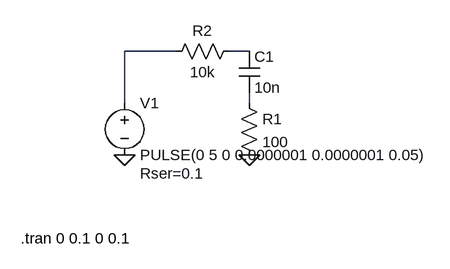
[diagram p0: schematic lowpass-trigger.asc]
lowpass-trigger.asc, the LTspice schematic file:
Version 4
SHEET 1 880 680
WIRE 64 64 -16 64
WIRE 176 64 144 64
WIRE -16 144 -16 64
WIRE 176 144 176 128
FLAG -16 224 0
FLAG 176 224 0
SYMBOL voltage -16 128 R0
WINDOW 123 0 0 Left 0
WINDOW 39 24 124 Left 2
SYMATTR InstName V1
SYMATTR Value PULSE(0 5 0 0.0000001 0.0000001 0.05)
SYMATTR SpiceLine Rser=0.1
SYMBOL cap 160 64 R0
SYMATTR InstName C1
SYMATTR Value 10n
SYMBOL res 160 128 R0
SYMATTR InstName R1
SYMATTR Value 100
SYMBOL res 160 48 R90
WINDOW 0 0 56 VBottom 2
WINDOW 3 32 56 VTop 2
SYMATTR InstName R2
SYMATTR Value 10k
TEXT -176 352 Left 2 !.tran 0 0.1 0 0.1

The netlist it stands for:
* lowpass-trigger.asc
V1 N001 0 PULSE(0 5 0 0.0000001 0.0000001 0.05) Rser=0.1
C1 N002 N003 10n
R1 N003 0 100
R2 N002 N001 10k
.tran 0 0.1 0 0.1
.backanno
.end